# EAGLE design cafetera (EAGLE 8.0.0)
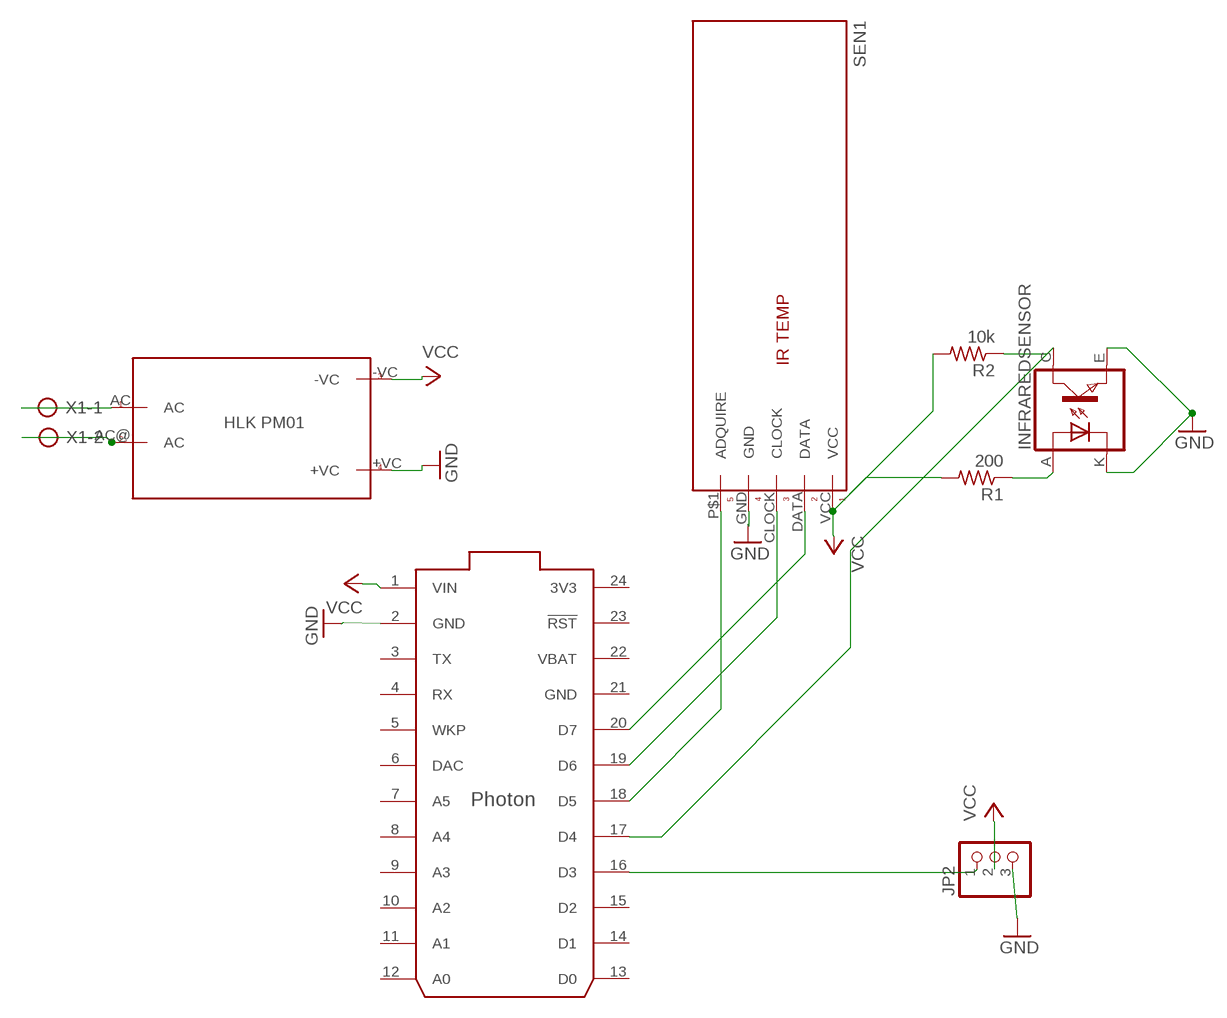
[diagram p0: schematic, sheet 1]

## Parts
INFRAREDSENSOR  TCRT5000  [TCRT5000]
JP2  PINHD-1X3/90  [1X03/90]
R1  200  R-US_0207/12  [0207/12]
R2  10k  R-US_0207/12  [0207/12]
SEN1  IRTEMP  [IRTEMP]
TRANS1  HLKPM01  [HLKPM01]
U$1  PHOTON_WITH_HEADERS  [PHOTON]
X1  AK500/2-H  [AK500/2-H]

## Nets
GND: INFRAREDSENSOR.E(EMITTER) INFRAREDSENSOR.K(CATHODE) JP2.3 SEN1.GND TRANS1.+VC U$1.2(GND)
N$1: INFRAREDSENSOR.A(ANODE) R1.1
N$3: TRANS1.AC X1.1
N$4: R2.1 U$1.17(D4)
N$6: TRANS1.AC@(AC) X1.2
N$7: SEN1.DATA U$1.20(D7)
N$8: SEN1.CLOCK U$1.19(D6)
N$9: SEN1.P$1(ADQUIRE) U$1.18(D5)
N$10: JP2.1 U$1.16(D3)
VCC: JP2.2 R1.2 R2.2 SEN1.VCC TRANS1.-VC U$1.1(VIN)
Unconnected: INFRAREDSENSOR.C(COLLECTOR) U$1.3(TX) U$1.4(RX) U$1.5(WKP) U$1.6(DAC) U$1.7(A5) U$1.8(A4) U$1.9(A3) U$1.10(A2) U$1.11(A1) U$1.12(A0) U$1.13(D0) U$1.14(D1) U$1.15(D2) U$1.23(!RST)

## Power pins joined to a net without a drawn wire
3V3: U$1.24(3V3)
GND: U$1.21(GND)
VBAT: U$1.22(VBAT)

## Library data of the parts
INFRAREDSENSOR = tcrt5000:TCRT5000
JP2 = pinhead:PINHD-1X3: PIN HEADER
R1 R2 = rcl:R-US_: RESISTOR, American symbol
SEN1 = CTILibrary:IRTEMP: Power supply: 3V to 5V DC Measurement temperature: -33 to +220 °C Accuracy at read temp 15~35°C / ambient 25°C: +/-0.6°C Full range accuracy: +/-2%, 2°C Resolution: 0.0625°C (full range) Response time (90%): 1 second Distance:Spot ratio: 1:1 Emissivity: 0.01~1 step 0.01 Update frequency: 1.4Hz Wave length: 5um-14um On-board voltage regulator and communications interface Dimensions: 35(W) x 14(H) x 12(D)mm
TRANS1 = Transformadores:HLKPM01: 1. Meet UL, CE requirements, 2. Ultra-thin, ultra-small 2. All voltage input (AC: 90 ~ 264V) 3. Low ripple and low noise 4. Output overload and short circuit protection 5. High efficiency, high power density 6. The product is designed to meet the requirements of EMC and Safety Test 7. Low power consumption, environmental protection, no-load loss <0.1W 8.100% load aging and testing
U$1 = Spark:PHOTON
X1 = con-ptr500:AK500/2-H: CONNECTOR Aug. 2004 / PTR Meßtechnik: Die Bezeichnung der Serie AK505 wurde geändert. Es handelt sich hierbei um AK500 in horizontaler Ausführung.; OC_FARNELL: unknown; OC_NEWARK: unknown

## Board
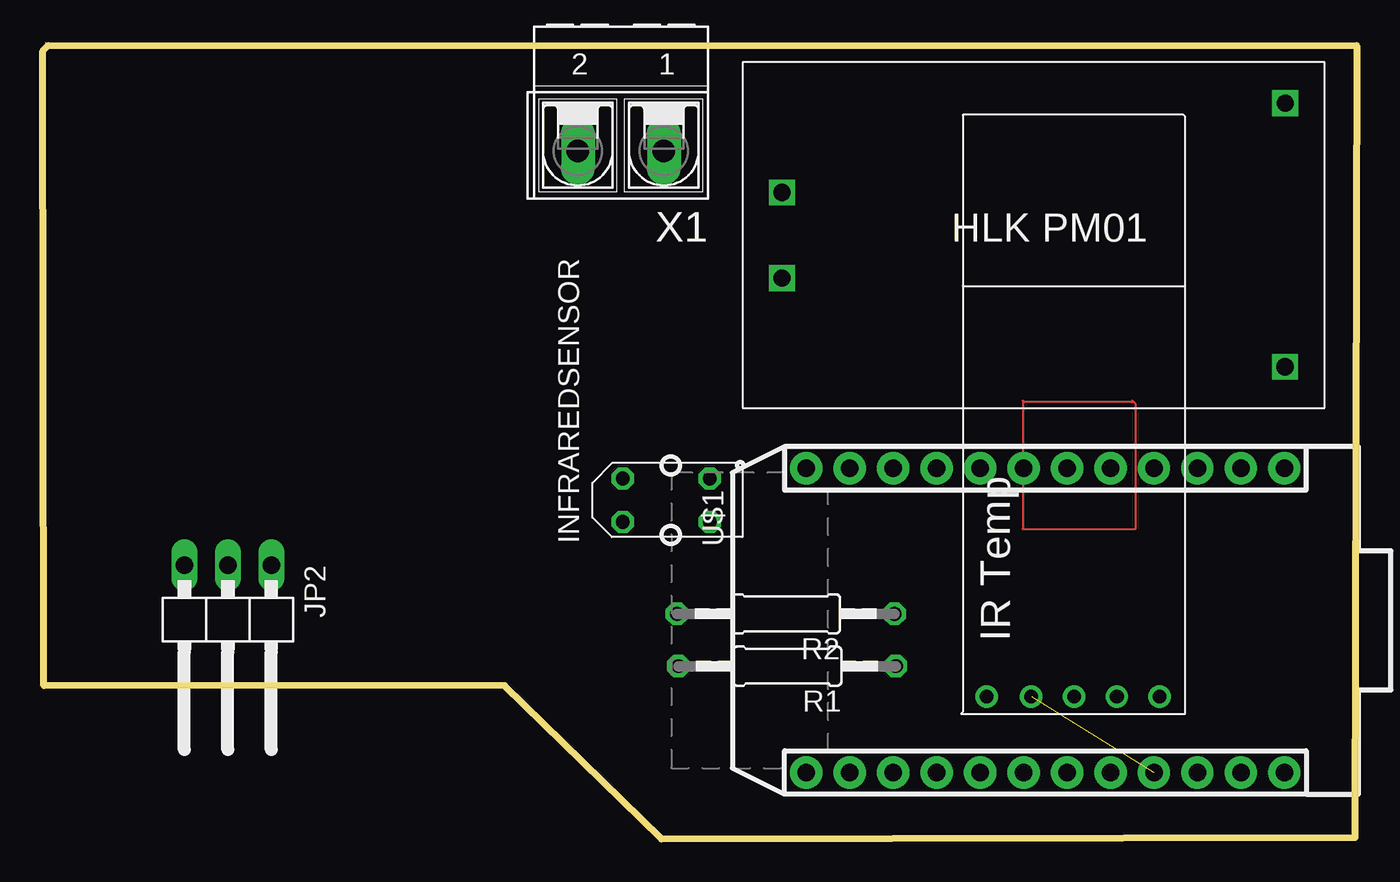
[diagram p1: board, top side]
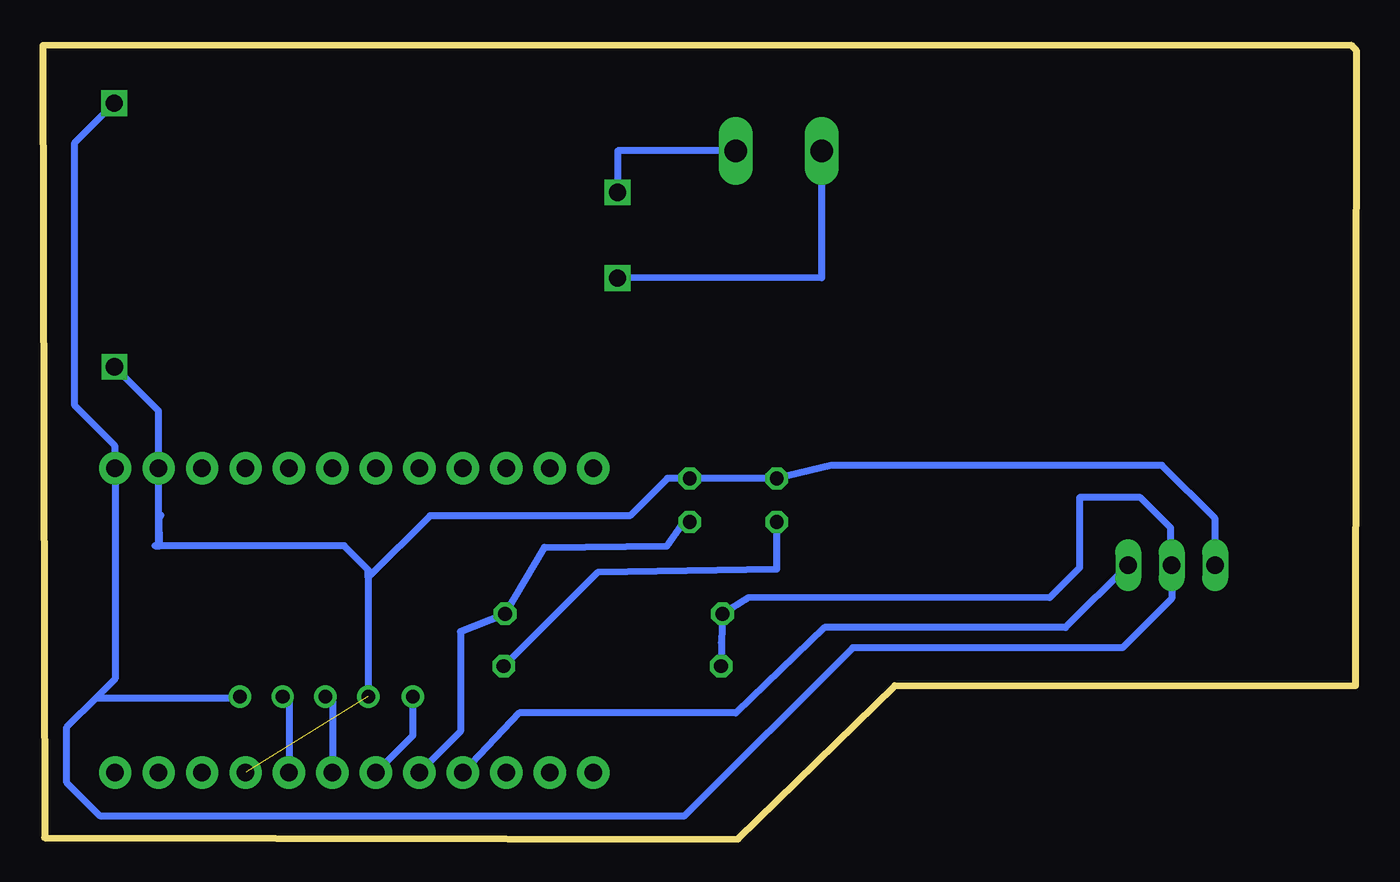
[diagram p2: board, bottom side, seen from below]

Size 76.78 x 46.54 mm. Coordinates in mm from the lower left corner, seen from the top.
Outline: 76.67,0.02 76.74,46.44 0.15,46.54
Outline: 76.78,46.35 76.67,0.08 36.12,0
Outline: 36.14,0.02 26.99,8.96 0.07,8.97 0,46.06 0.33,46.39 76.78,46.37 76.75,46.33
Copper layers (1*16): Top 0.035mm / dielectric 1.5mm / Bottom 0.035mm
Design rules "default": minimum track width 10mil, minimum drill 24mil, track to track 8mil, track to pad 8mil, pad to pad 8mil, via to via 8mil, smd to smd 8mil, copper to edge 40mil, drill to drill 8mil, minimum pad ring 10mil, minimum via ring 8mil, stop-mask expansion 4mil, vias tented up to drill 0mil, thermal gap 10mil

### Footprints (pad centres in the part's own frame; a part is rotated, then mirrored left to right if it is on the bottom)
TCRT5000 = drill 0.8 octagon: A -2.54,-1.27; C 2.54,-1.27; E 2.54,1.27; K -2.54,1.27
1X03/90 = drill 1.016 long: 1 -2.54,-3.81; 2 0,-3.81; 3 2.54,-3.81
0207/12 = drill 0.813 octagon: 1 -6.35,0; 2 6.35,0
IRTEMP = drill 0.8: CLOCK 34,6.5; DATA 34,9; GND 34,4; P$1 34,1.4; VCC 34,11.5
HLKPM01 = drill 1 square: +VC 31.688,2.402; -VC 31.709,17.804; AC 2.301,12.598; AC@ 2.296,7.597
PHOTON = drill 1.016 pad 1.88: 1 1.27,32.258; 2 1.27,29.718; 3 1.27,27.178; 4 1.27,24.638; 5 1.27,22.098; 6 1.27,19.558; 7 1.27,17.018; 8 1.27,14.478; 9 1.27,11.938; 10 1.27,9.398; 11 1.27,6.858; 12 1.27,4.318; 13 19.05,4.318; 14 19.05,6.858; 15 19.05,9.398; 16 19.05,11.938; 17 19.05,14.478; 18 19.05,17.018; 19 19.05,19.558; 20 19.05,22.098; 21 19.05,24.638; 22 19.05,27.178; 23 19.05,29.718; 24 19.05,32.258
AK500/2-H = drill 1.321 long: 1 -2.515,0; 2 2.515,0

### Placement (x,y rotation side)
INFRAREDSENSOR  36.44,19.81 0 top
JP2  10.82,12.2 180 top
R1  43.49,10.11 180 top
R2  43.41,13.16 180 top
SEN1  53.76,42.33 270 top
TRANS1  40.9,25.2 0 top
U$1  40.29,22.94 270 top
X1  33.78,40.23 180 top

### Tracks (layer width: path | path; a pad name or v marks a point on that pad's centre or on a via)
GND  (1 unrouted)
  Bottom 0.406: 69.99,18.79 U$1.2 | 69.99,18.79 69.98,17.13 70.21,17.14 59.16,17.14 57.76,15.73 57.76,15.28 | JP2.3 8.28,18.74 11.38,21.84 30.71,21.84 INFRAREDSENSOR.K INFRAREDSENSOR.E 40.27,21.08 42.46,18.88 54.15,18.88 57.76,15.28 | 69.99,17.13 U$1.2 | 57.76,15.28 SEN1.GND | 69.86,18.92 69.99,18.79 | U$1.2 70.01,25.02 TRANS1.+VC
N$1
  Bottom 0.406: INFRAREDSENSOR.A 33.89,15.76 44.37,15.58 R1.1
N$3
  Bottom 0.406: X1.1 43.19,40.23 TRANS1.AC
N$4
  Bottom 0.406: U$1.17 52.37,6.29 52.37,12.13 R2.1 47.47,17.05 40.31,17.12 39.4,18.4 39.11,18.4
N$6
  Bottom 0.406: X1.2 31.27,32.81 TRANS1.AC@
N$7
  Bottom 0.406: SEN1.DATA 62.39,8.33 U$1.20
N$8
  Bottom 0.406: SEN1.CLOCK 59.85,8.33 U$1.19
N$9
  Bottom 0.406: SEN1.P$1 55.16,6.04 U$1.18
N$10  (via drill 0.6)
  Bottom 0.406: JP2.1 17.01,12.36 31.1,12.36 36.28,7.36 48.94,7.36 U$1.16
  other vias: 13.36,16.01
VCC
  Bottom 0.406: 10.74,16.01 JP2.2 | JP2.2 10.97,16.16 | JP2.2 10.8,16.01 | 72.58,21.71 U$1.1 | 65.35,8.24 SEN1.VCC 65.32,8.27 73.65,8.27 | JP2.2 10.82,14.05 13.69,11.18 29.45,11.18 39.3,1.33 73.41,1.33 75.37,3.29 75.37,6.55 73.65,8.27 | U$1.1 72.55,22.97 74.9,25.32 74.9,40.7 TRANS1.-VC | U$1.1 72.55,9.36 73.65,8.27 | JP2.2 10.87,16.07 10.87,18.19 12.64,19.95 16.2,19.95 16.2,15.85 17.94,14.12 35.56,14.1 R2.2 37.13,11.48 R1.2